# Altium schematic sheet STRWHL-S04-V00-PSU.SchDoc: Power Supply (9-25V to 3v3 @ 0.1-0.3A)
size A3; DrawnBy: Jonn Dillon; DocumentNumber: 4; Revision: 00; SheetNumber: 4; SheetTotal: 9; Project: Steering Wheel 2020; PageSetup: Record=PageOptions|CenterHorizontal=True|CenterVertical=True|PrintScale=0.97|XCorrection=1.00|YCorrection=1.00|PrintKind=0|BorderSize=5000000|LeftOffset=0|BottomOffset=0|Orientation=2|PaperLength=1000|PaperWidth=1000|Scale=100|PaperSource=7|PrintQuality=-4|MediaType=1|DitherType=10|PaperKind=A4|PrintScaleMode=1
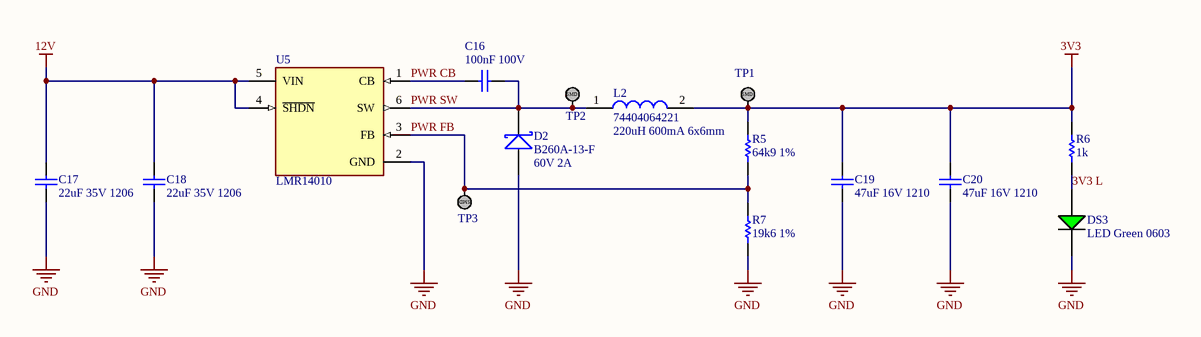
[diagram p0: STRWHL-S04-V00-PSU.SchDoc]

## Parts
C16  100nF 100V  [Cap_Ceramic_0603]
C17  22uF 35V 1206  [Cap_Ceramic_1206]
C18  22uF 35V 1206  [Cap_Ceramic_1206]
C19  47uF 16V 1210  [Cap_Ceramic_1210]
C20  47uF 16V 1210  [Cap_Ceramic_1210]
D2  B260A-13-F  [SMA]
DS3  LED Green 0603  [LED GREEN 0603]
L2  74404064221  [Inductor_6x6mm]
R5  64k9 1%  [Res_ThinFilm_0603]
R6  1k  [Res_ThinFilm_0603]
R7  19k6 1%  [Res_ThinFilm_0603]
TP1  TestPoint_SMD  [TestPointSMD]  (value not drawn)
TP2  TestPoint_SMD  [TestPointSMD]  (value not drawn)
TP3  TestPoint_SMD  [TestPointSMD]  (value not drawn)
U5  LMR14010  [LMR14010]

## Nets
3V3: C19.2 C20.2 L2.2 R5.2 R6.2 TP1.1
12V: C17.2 C18.2 U5.4(~{SHDN}) U5.5(VIN)
GND: C17.1 C18.1 C19.1 C20.1 D2.A DS3.2(C) R7.1 U5.2(GND)
3V3 L: DS3.1(A) R6.1
PWR CB: C16.1 U5.1(CB)
PWR FB: R5.1 R7.2 TP3.1 U5.3(FB)
PWR SW: C16.2 D2.K L2.1 TP2.1 U5.6(SW)

## Notes on the sheet
- (near L2) 220uH 600mA 6x6mm
- (near D2) 60V 2A
- Revision History:
- Sheet Title:
- Rev
- Date
- Description
- Project:
- Size:
- Drawn By:
- A3
- Number:
- Revision:
- Sheet
- Version:
- of
- QUT Motorsport
- O-120, Gardens Point
- 2 George Street
- Brisbane, QLD 4000
- Australia
- Print Date:
- Print Time:
- File Name:
- (in symbol TestPoint_SMD) SMD

## Library data of the parts
C16 = 100nF 100V 5% X7R 0603: Capacitor, Ceramic, SMD, 100nF, 100V, 5%, X7R, 0603
C17 C18 = 22uF 35V 10% X7R 1206: Capacitor, Ceramic, SMD, 22uF, 35V, 10%, X7R, 1206
C19 C20 = 47uF 16V 10% X7R 1210: Capacitor, Ceramic, SMD, 47uF, 16V, 5%, X7R, 1210
D2 = B260A-13-F: Diode, Schottky Barrier Rectifier, 60 V, 2 A, B260A-13-F
L2 = 74404064221: FIXED IND 220UH 660MA 850 MOHM; ComponentLink1Description: Digikey; ComponentLink1URL: https://www.digikey.com.au/product-detail/en/w%C3%BCrth-elektronik/74404064221/732-7261-1-ND/5353241; ComponentLink2Description: LCSC A; ComponentLink2URL: https://lcsc.com/product-detail/Power-Inductors_Sunlord-SWPA6045S221MT_C91047.html; ComponentLink3Description: LCSC B; ComponentLink3URL: https://lcsc.com/product-detail/Power-Inductors_SXN-Shun-Xiang-Nuo-Elec-SMNR6045-221MT_C467145.html
R5 = 64k9 1% 0603: Resistor, SMD, 64k9, 0.1W, 5%, 0603
R6 = 1k 5% 0603: Resistor, SMD, 1k, 0.1W, 5%, 0603
R7 = 19k6 1% 0603: Resistor, SMD, 19k6, 0.1W, 5%, 0603